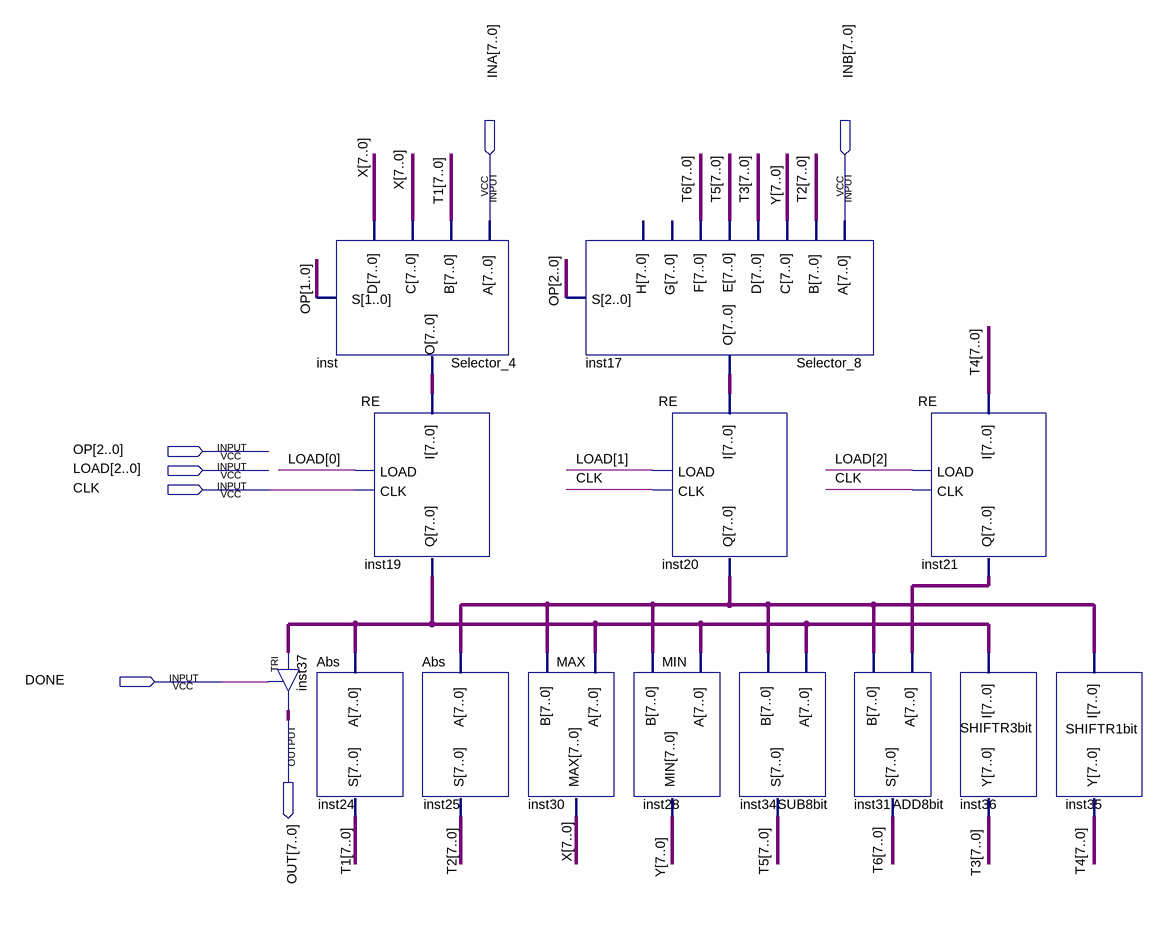
[diagram p0: schematic sheet]
// Quartus schematic Datapath.bdf as structural Verilog: 14 symbols, 7 pins
module Datapath (
  input  [7:0] INA,
  input  [7:0] INB,
  input  [2:0] OP,
  input  [2:0] LOAD,
  input  CLK,
  input  DONE,
  output [7:0] OUT
);

  wire [7:0] inst17_o, inst19_q, inst20_q, inst21_q, inst_o, T1, T2, T3, T4, T5, T6, X, Y;

  Selector_4 inst (.A(INA), .B(T1), .C(X), .D(X), .S(OP[1:0]), .O(inst_o));
  Abs inst24 (.A(inst19_q), .S(T1));
  TRI inst37[7:0] (.IN(inst19_q), .OE(DONE), .OUT(OUT));
  RE inst19 (.I(inst_o), .LOAD(LOAD[0]), .CLK(CLK), .Q(inst19_q));
  Abs inst25 (.A(inst20_q), .S(T2));
  MAX inst30 (.A(inst19_q), .B(inst20_q), .MAX(X));
  Selector_8 inst17 (.A(INB), .B(T2), .C(Y), .D(T3), .E(T5), .F(T6), .S(OP), .O(inst17_o));  // open: G, H
  MIN inst28 (.A(inst19_q), .B(inst20_q), .MIN(Y));
  RE inst20 (.I(inst17_o), .LOAD(LOAD[1]), .CLK(CLK), .Q(inst20_q));
  SUB8bit inst34 (.A(inst19_q), .B(inst20_q), .S(T5));
  ADD8bit inst31 (.A(inst21_q), .B(inst20_q), .S(T6));
  RE inst21 (.I(T4), .LOAD(LOAD[2]), .CLK(CLK), .Q(inst21_q));
  SHIFTR3bit inst36 (.I(inst19_q), .Y(T3));
  SHIFTR1bit inst35 (.I(inst20_q), .Y(T4));
endmodule
